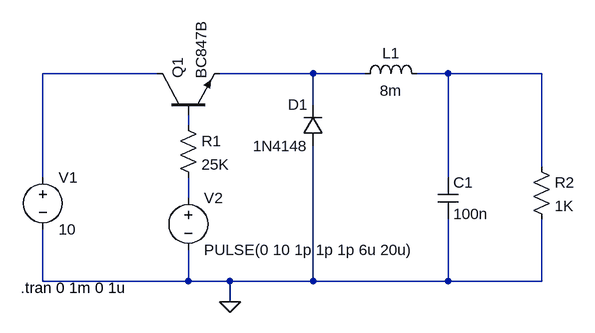
[diagram p0: schematic buck-converter.asc]
buck-converter.asc, the LTspice schematic file:
Version 4
SHEET 1 984 680
WIRE 288 -16 112 -16
WIRE 528 -16 384 -16
WIRE 608 -16 528 -16
WIRE 736 -16 688 -16
WIRE 880 -16 736 -16
WIRE 528 32 528 -16
WIRE 336 64 336 48
WIRE 880 128 880 -16
WIRE 112 144 112 -16
WIRE 736 144 736 -16
WIRE 336 176 336 144
WIRE 112 304 112 224
WIRE 336 304 336 256
WIRE 336 304 112 304
WIRE 400 304 336 304
WIRE 528 304 528 96
WIRE 528 304 400 304
WIRE 736 304 736 208
WIRE 736 304 528 304
WIRE 880 304 880 208
WIRE 880 304 736 304
WIRE 400 336 400 304
FLAG 400 336 0
SYMBOL voltage 112 128 R0
SYMATTR InstName V1
SYMATTR Value 10
SYMBOL voltage 336 160 R0
WINDOW 123 0 0 Left 0
WINDOW 39 0 0 Left 0
SYMATTR InstName V2
SYMATTR Value PULSE(0 10 1p 1p 1p 6u 20u)
SYMBOL res 320 48 R0
SYMATTR InstName R1
SYMATTR Value 25K
SYMBOL res 864 112 R0
SYMATTR InstName R2
SYMATTR Value 1K
SYMBOL cap 720 144 R0
SYMATTR InstName C1
SYMATTR Value 100n
SYMBOL ind 592 0 R270
WINDOW 0 32 56 VTop 2
WINDOW 3 5 56 VBottom 2
SYMATTR InstName L1
SYMATTR Value 8m
SYMBOL diode 544 96 R180
WINDOW 0 24 64 Left 2
WINDOW 3 24 0 Left 2
SYMATTR InstName D1
SYMATTR Value 1N4148
SYMBOL npn 288 48 R270
SYMATTR InstName Q1
SYMATTR Value BC847B
TEXT 78 314 Left 2 !.tran 0 1m 0 1u

The netlist it stands for:
* buck-converter.asc
V1 N001 0 10
V2 N005 0 PULSE(0 10 1p 1p 1p 6u 20u)
R1 N004 N005 25K
R2 N003 0 1K
C1 N003 0 100n
L1 N002 N003 8m
D1 0 N002 1N4148
Q1 N001 N004 N002 0 BC847B
.model D D
.lib standard.dio
.model NPN NPN
.model PNP PNP
.lib standard.bjt
.tran 0 1m 0 1u
.backanno
.end